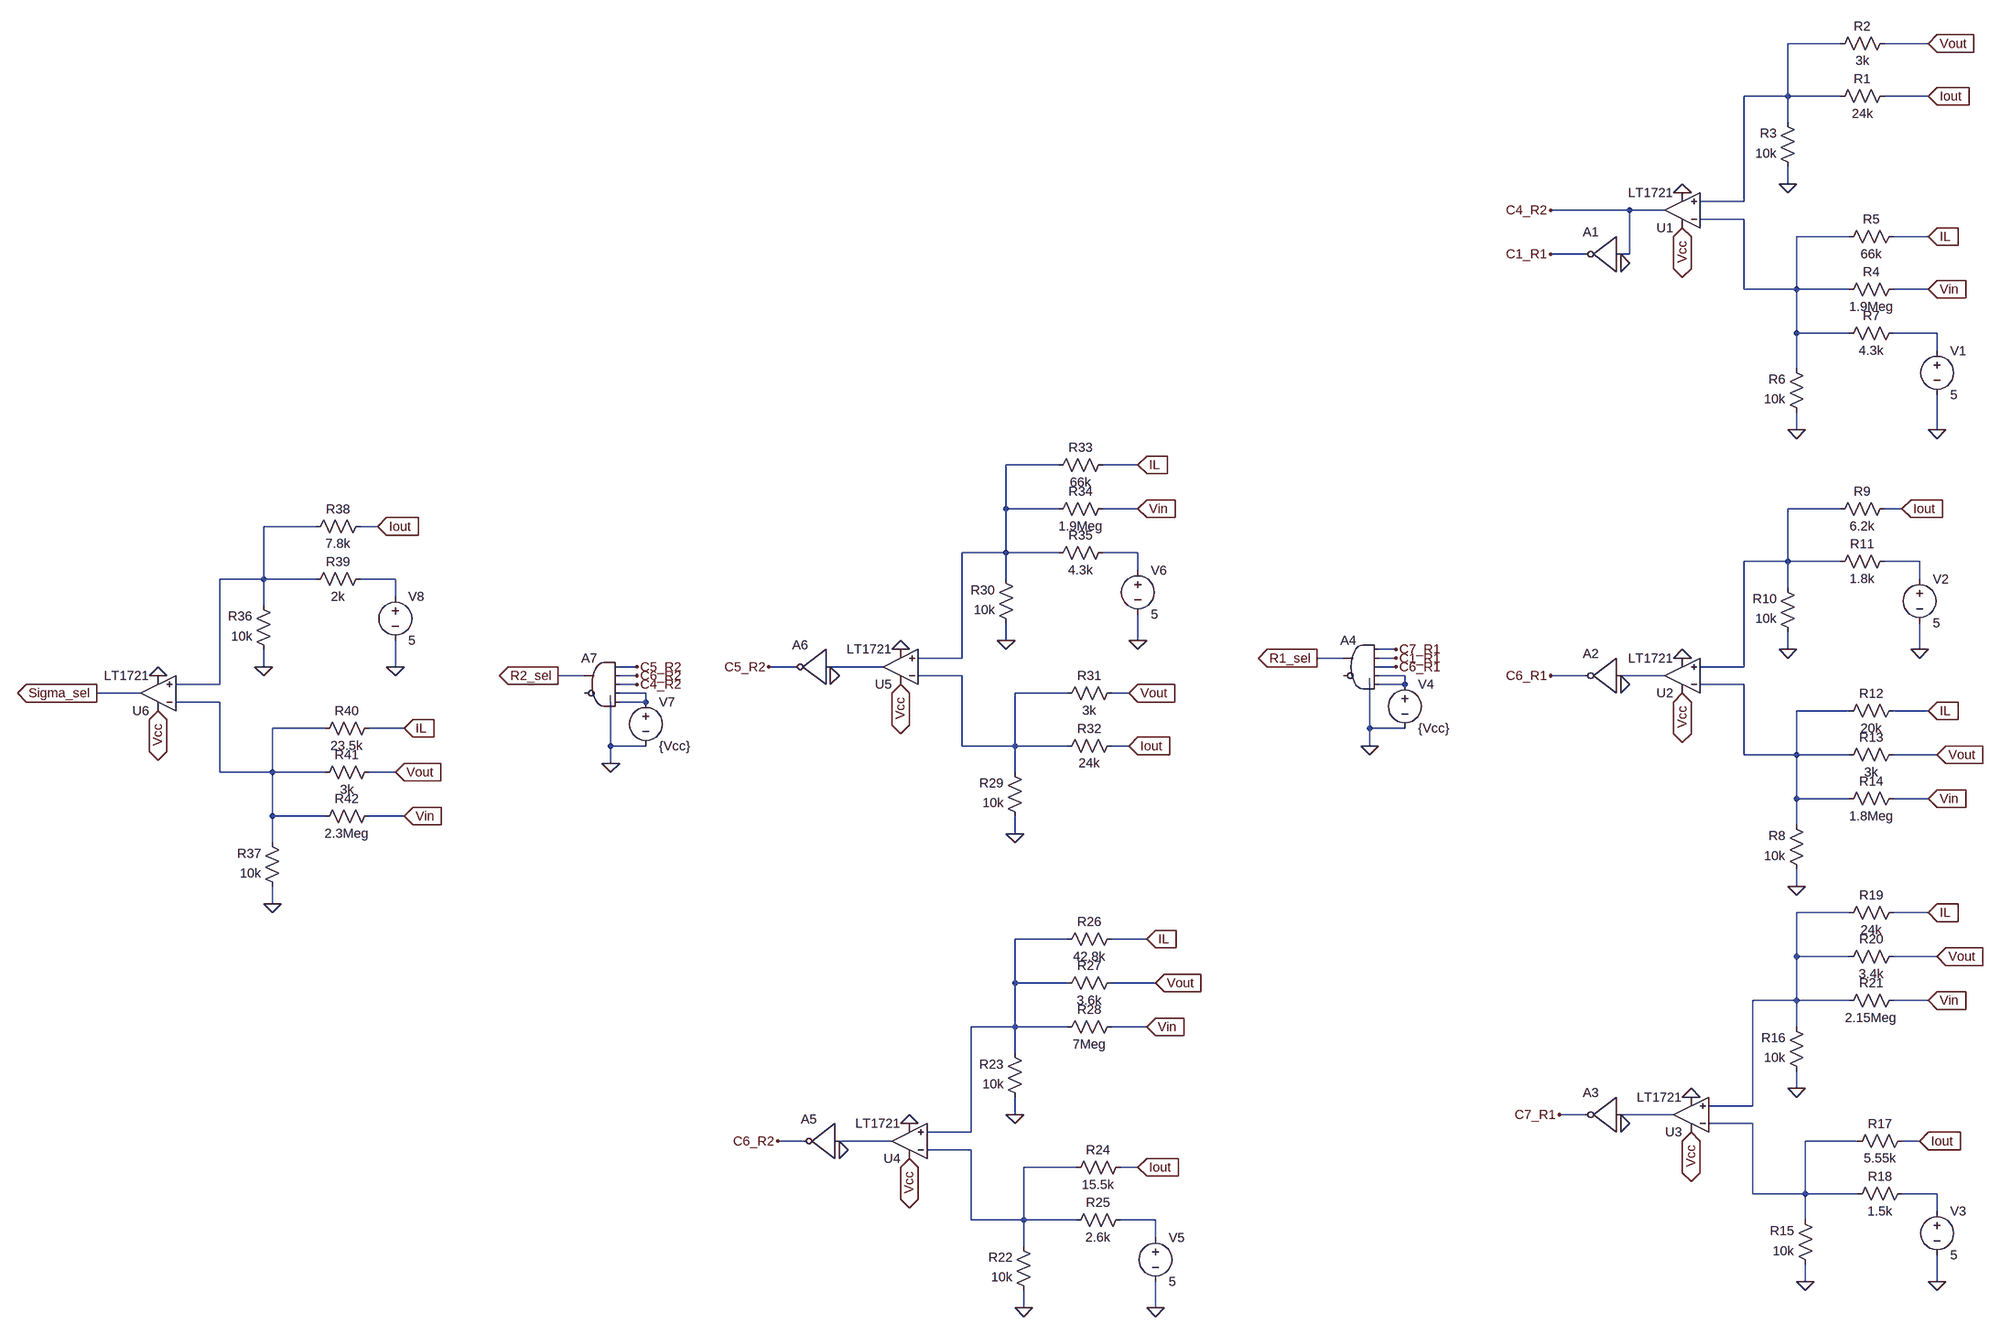
[diagram p0: schematic Region_detection.asc]
Region_detection.asc, the LTspice schematic file:
Version 4.1
SHEET 1 1664 2196
WIRE 304 -192 208 -192
WIRE 464 -192 384 -192
WIRE 208 -96 208 -192
WIRE 208 -96 128 -96
WIRE 304 -96 208 -96
WIRE 464 -96 384 -96
WIRE 208 -48 208 -96
WIRE 208 64 208 32
WIRE 128 96 128 -96
WIRE 128 96 48 96
WIRE -80 112 -224 112
WIRE -16 112 -80 112
WIRE 128 128 48 128
WIRE 320 160 224 160
WIRE 464 160 400 160
WIRE -160 192 -224 192
WIRE -80 192 -80 112
WIRE -80 192 -96 192
WIRE 128 256 128 128
WIRE 224 256 224 160
WIRE 224 256 128 256
WIRE 320 256 224 256
WIRE 464 256 400 256
WIRE 224 336 224 256
WIRE 320 336 224 336
WIRE 480 336 400 336
WIRE 480 368 480 336
WIRE 224 400 224 336
WIRE 224 512 224 480
WIRE 480 512 480 448
WIRE -1168 576 -1264 576
WIRE -1024 576 -1088 576
WIRE -1264 656 -1264 576
WIRE -1168 656 -1264 656
WIRE -1024 656 -1088 656
WIRE 304 656 208 656
WIRE 416 656 384 656
WIRE -2592 688 -2688 688
WIRE -2480 688 -2512 688
WIRE -1264 736 -1264 656
WIRE -1264 736 -1344 736
WIRE -1168 736 -1264 736
WIRE -1024 736 -1088 736
WIRE 208 752 208 656
WIRE 208 752 128 752
WIRE 304 752 208 752
WIRE 448 752 384 752
WIRE -1024 768 -1024 736
WIRE -2688 784 -2688 688
WIRE -2688 784 -2768 784
WIRE -2592 784 -2688 784
WIRE -2448 784 -2512 784
WIRE -1264 784 -1264 736
WIRE 448 784 448 752
WIRE 208 800 208 752
WIRE -2448 816 -2448 784
WIRE -2688 832 -2688 784
WIRE -1264 896 -1264 864
WIRE -1024 896 -1024 848
WIRE -512 912 -544 912
WIRE 208 912 208 880
WIRE 448 912 448 864
WIRE -1344 928 -1344 736
WIRE -1344 928 -1424 928
WIRE -608 928 -656 928
WIRE -512 928 -544 928
WIRE -2688 944 -2688 912
WIRE -2448 944 -2448 896
WIRE -1936 944 -1968 944
WIRE -1648 944 -1696 944
WIRE -1488 944 -1584 944
WIRE -512 944 -544 944
WIRE 128 944 128 752
WIRE 128 944 48 944
WIRE -2032 960 -2080 960
WIRE -1936 960 -1968 960
WIRE -1344 960 -1424 960
WIRE -496 960 -544 960
WIRE -160 960 -224 960
WIRE -16 960 -96 960
WIRE -2768 976 -2768 784
WIRE -2768 976 -2848 976
WIRE -1936 976 -1968 976
WIRE -496 976 -496 960
WIRE -496 976 -544 976
WIRE 128 976 48 976
WIRE -2912 992 -2992 992
WIRE -1920 992 -1968 992
WIRE -1152 992 -1248 992
WIRE -1040 992 -1072 992
WIRE -2768 1008 -2848 1008
WIRE -1920 1008 -1920 992
WIRE -1920 1008 -1968 1008
WIRE 320 1024 224 1024
WIRE 464 1024 400 1024
WIRE -2576 1056 -2672 1056
WIRE -2432 1056 -2496 1056
WIRE -560 1056 -560 976
WIRE -496 1056 -560 1056
WIRE -1984 1088 -1984 1008
WIRE -1920 1088 -1984 1088
WIRE -1344 1088 -1344 960
WIRE -1248 1088 -1248 992
WIRE -1248 1088 -1344 1088
WIRE -1152 1088 -1248 1088
WIRE -1040 1088 -1072 1088
WIRE -560 1088 -560 1056
WIRE 128 1104 128 976
WIRE 224 1104 224 1024
WIRE 224 1104 128 1104
WIRE 320 1104 224 1104
WIRE 480 1104 400 1104
WIRE -1984 1120 -1984 1088
WIRE -2768 1136 -2768 1008
WIRE -2672 1136 -2672 1056
WIRE -2672 1136 -2768 1136
WIRE -2576 1136 -2672 1136
WIRE -2448 1136 -2496 1136
WIRE -1248 1136 -1248 1088
WIRE 224 1184 224 1104
WIRE 320 1184 224 1184
WIRE 464 1184 400 1184
WIRE -2672 1216 -2672 1136
WIRE -2576 1216 -2672 1216
WIRE -2432 1216 -2496 1216
WIRE 224 1232 224 1184
WIRE -1248 1248 -1248 1216
WIRE -2672 1264 -2672 1216
WIRE 224 1344 224 1312
WIRE -2672 1376 -2672 1344
WIRE 320 1392 224 1392
WIRE 464 1392 400 1392
WIRE -1152 1440 -1248 1440
WIRE -1008 1440 -1072 1440
WIRE 224 1472 224 1392
WIRE 320 1472 224 1472
WIRE 480 1472 400 1472
WIRE -1248 1520 -1248 1440
WIRE -1152 1520 -1248 1520
WIRE -992 1520 -1072 1520
WIRE 224 1552 224 1472
WIRE 224 1552 144 1552
WIRE 320 1552 224 1552
WIRE 464 1552 400 1552
WIRE -1248 1600 -1248 1520
WIRE -1248 1600 -1328 1600
WIRE -1152 1600 -1248 1600
WIRE -1008 1600 -1072 1600
WIRE 224 1600 224 1552
WIRE -1248 1648 -1248 1600
WIRE 224 1712 224 1680
WIRE 144 1744 144 1552
WIRE 144 1744 64 1744
WIRE -1248 1760 -1248 1728
WIRE -160 1760 -208 1760
WIRE 0 1760 -96 1760
WIRE 144 1776 64 1776
WIRE -1328 1792 -1328 1600
WIRE -1328 1792 -1408 1792
WIRE -1632 1808 -1680 1808
WIRE -1472 1808 -1568 1808
WIRE 336 1808 240 1808
WIRE 448 1808 416 1808
WIRE -1328 1824 -1408 1824
WIRE -1136 1856 -1232 1856
WIRE -1024 1856 -1056 1856
WIRE 144 1904 144 1776
WIRE 240 1904 240 1808
WIRE 240 1904 144 1904
WIRE 336 1904 240 1904
WIRE 480 1904 416 1904
WIRE 480 1936 480 1904
WIRE -1328 1952 -1328 1824
WIRE -1232 1952 -1232 1856
WIRE -1232 1952 -1328 1952
WIRE -1136 1952 -1232 1952
WIRE -992 1952 -1056 1952
WIRE 240 1952 240 1904
WIRE -992 1984 -992 1952
WIRE -1232 2000 -1232 1952
WIRE 240 2064 240 2032
WIRE 480 2064 480 2016
WIRE -1232 2112 -1232 2080
WIRE -992 2112 -992 2064
FLAG 16 80 0
FLAG 208 64 0
FLAG 224 512 0
FLAG 464 -192 Vout
IOPIN 464 -192 In
FLAG 464 -96 Iout
IOPIN 464 -96 In
FLAG 464 160 IL
IOPIN 464 160 In
FLAG 464 256 Vin
IOPIN 464 256 In
FLAG 480 512 0
FLAG -224 192 C1_R1
FLAG 16 144 Vcc
IOPIN 16 144 BiDir
FLAG -96 208 0
FLAG -224 112 C4_R2
FLAG 16 928 0
FLAG 208 912 0
FLAG -224 960 C6_R1
FLAG 16 992 Vcc
IOPIN 16 992 BiDir
FLAG 224 1344 0
FLAG 448 912 0
FLAG 416 656 Iout
IOPIN 416 656 In
FLAG 464 1024 IL
IOPIN 464 1024 In
FLAG 480 1104 Vout
IOPIN 480 1104 In
FLAG 464 1184 Vin
IOPIN 464 1184 In
FLAG 32 1728 0
FLAG 240 2064 0
FLAG -208 1760 C7_R1
FLAG 32 1792 Vcc
IOPIN 32 1792 BiDir
FLAG 224 1712 0
FLAG 480 2064 0
FLAG 448 1808 Iout
IOPIN 448 1808 In
FLAG 464 1392 IL
IOPIN 464 1392 In
FLAG 480 1472 Vout
IOPIN 480 1472 In
FLAG 464 1552 Vin
IOPIN 464 1552 In
FLAG -96 976 0
FLAG -96 1776 0
FLAG -560 1088 0
FLAG -656 928 R1_sel
IOPIN -656 928 Out
FLAG -512 944 C6_R1
FLAG -512 928 C1_R1
FLAG -512 912 C7_R1
FLAG -1440 1776 0
FLAG -1232 2112 0
FLAG -1680 1808 C6_R2
FLAG -1440 1840 Vcc
IOPIN -1440 1840 BiDir
FLAG -1248 1760 0
FLAG -992 2112 0
FLAG -1024 1856 Iout
IOPIN -1024 1856 In
FLAG -1008 1440 IL
IOPIN -1008 1440 In
FLAG -992 1520 Vout
IOPIN -992 1520 In
FLAG -1008 1600 Vin
IOPIN -1008 1600 In
FLAG -1568 1824 0
FLAG -1456 912 0
FLAG -1248 1248 0
FLAG -1696 944 C5_R2
FLAG -1456 976 Vcc
IOPIN -1456 976 BiDir
FLAG -1264 896 0
FLAG -1024 896 0
FLAG -1040 1088 Iout
IOPIN -1040 1088 In
FLAG -1024 576 IL
IOPIN -1024 576 In
FLAG -1024 656 Vin
IOPIN -1024 656 In
FLAG -1040 992 Vout
IOPIN -1040 992 In
FLAG -1584 960 0
FLAG -1984 1120 0
FLAG -2080 960 R2_sel
IOPIN -2080 960 Out
FLAG -1936 960 C6_R2
FLAG -1936 944 C5_R2
FLAG -2880 960 0
FLAG -2688 944 0
FLAG -2880 1024 Vcc
IOPIN -2880 1024 BiDir
FLAG -2672 1376 0
FLAG -2448 944 0
FLAG -2480 688 Iout
IOPIN -2480 688 In
FLAG -2432 1056 IL
IOPIN -2432 1056 In
FLAG -2448 1136 Vout
IOPIN -2448 1136 In
FLAG -2432 1216 Vin
IOPIN -2432 1216 In
FLAG -2992 992 Sigma_sel
IOPIN -2992 992 Out
FLAG -1936 976 C4_R2
SYMBOL Comparators\\LT1721 16 176 R180
SYMATTR InstName U1
SYMBOL res 400 -112 R90
WINDOW 0 0 56 VBottom 2
WINDOW 3 32 56 VTop 2
SYMATTR InstName R1
SYMATTR Value 24k
SYMBOL res 400 -208 R90
WINDOW 0 0 56 VBottom 2
WINDOW 3 32 56 VTop 2
SYMATTR InstName R2
SYMATTR Value 3k
SYMBOL res 224 48 R180
WINDOW 0 36 76 Left 2
WINDOW 3 36 40 Left 2
SYMATTR InstName R3
SYMATTR Value 10k
SYMBOL res 416 240 R90
WINDOW 0 0 56 VBottom 2
WINDOW 3 32 56 VTop 2
SYMATTR InstName R4
SYMATTR Value 1.9Meg
SYMBOL res 416 144 R90
WINDOW 0 0 56 VBottom 2
WINDOW 3 32 56 VTop 2
SYMATTR InstName R5
SYMATTR Value 66k
SYMBOL res 240 496 R180
WINDOW 0 36 76 Left 2
WINDOW 3 36 40 Left 2
SYMATTR InstName R6
SYMATTR Value 10k
SYMBOL res 416 320 R90
WINDOW 0 0 56 VBottom 2
WINDOW 3 32 56 VTop 2
SYMATTR InstName R7
SYMATTR Value 4.3k
SYMBOL voltage 480 352 R0
WINDOW 123 0 0 Left 0
WINDOW 39 0 0 Left 0
SYMATTR InstName V1
SYMATTR Value 5
SYMBOL Digital\\inv -96 128 M0
SYMATTR InstName A1
SYMATTR SpiceLine Vhigh={Vcc_param*10} Vlow=0 Rout=10m Trise=10n Tfall=10n Ref=2.5
SYMBOL Comparators\\LT1721 16 1024 R180
SYMATTR InstName U2
SYMBOL res 224 896 R180
WINDOW 0 36 76 Left 2
WINDOW 3 36 40 Left 2
SYMATTR InstName R10
SYMATTR Value 10k
SYMBOL res 240 1328 R180
WINDOW 0 36 76 Left 2
WINDOW 3 36 40 Left 2
SYMATTR InstName R8
SYMATTR Value 10k
SYMBOL res 400 640 R90
WINDOW 0 0 56 VBottom 2
WINDOW 3 32 56 VTop 2
SYMATTR InstName R9
SYMATTR Value 6.2k
SYMBOL res 400 736 R90
WINDOW 0 0 56 VBottom 2
WINDOW 3 32 56 VTop 2
SYMATTR InstName R11
SYMATTR Value 1.8k
SYMBOL voltage 448 768 R0
WINDOW 123 0 0 Left 0
WINDOW 39 0 0 Left 0
SYMATTR InstName V2
SYMATTR Value 5
SYMBOL res 416 1008 R90
WINDOW 0 0 56 VBottom 2
WINDOW 3 32 56 VTop 2
SYMATTR InstName R12
SYMATTR Value 20k
SYMBOL res 416 1088 R90
WINDOW 0 0 56 VBottom 2
WINDOW 3 32 56 VTop 2
SYMATTR InstName R13
SYMATTR Value 3k
SYMBOL res 416 1168 R90
WINDOW 0 0 56 VBottom 2
WINDOW 3 32 56 VTop 2
SYMATTR InstName R14
SYMATTR Value 1.8Meg
SYMBOL Comparators\\LT1721 32 1824 R180
SYMATTR InstName U3
SYMBOL res 256 2048 R180
WINDOW 0 36 76 Left 2
WINDOW 3 36 40 Left 2
SYMATTR InstName R15
SYMATTR Value 10k
SYMBOL res 240 1696 R180
WINDOW 0 36 76 Left 2
WINDOW 3 36 40 Left 2
SYMATTR InstName R16
SYMATTR Value 10k
SYMBOL res 432 1792 R90
WINDOW 0 0 56 VBottom 2
WINDOW 3 32 56 VTop 2
SYMATTR InstName R17
SYMATTR Value 5.55k
SYMBOL res 432 1888 R90
WINDOW 0 0 56 VBottom 2
WINDOW 3 32 56 VTop 2
SYMATTR InstName R18
SYMATTR Value 1.5k
SYMBOL voltage 480 1920 R0
WINDOW 123 0 0 Left 0
WINDOW 39 0 0 Left 0
SYMATTR InstName V3
SYMATTR Value 5
SYMBOL res 416 1376 R90
WINDOW 0 0 56 VBottom 2
WINDOW 3 32 56 VTop 2
SYMATTR InstName R19
SYMATTR Value 24k
SYMBOL res 416 1456 R90
WINDOW 0 0 56 VBottom 2
WINDOW 3 32 56 VTop 2
SYMATTR InstName R20
SYMATTR Value 3.4k
SYMBOL res 416 1536 R90
WINDOW 0 0 56 VBottom 2
WINDOW 3 32 56 VTop 2
SYMATTR InstName R21
SYMATTR Value 2.15Meg
SYMBOL Digital\\inv -96 896 M0
SYMATTR InstName A2
SYMATTR SpiceLine Vhigh={Vcc_param*10} Vlow=0 Rout=10m Trise=10n Tfall=10n Ref=2.5
SYMBOL Digital\\inv -96 1696 M0
SYMATTR InstName A3
SYMATTR SpiceLine Vhigh={Vcc_param*10} Vlow=0 Rout=10m Trise=10n Tfall=10n Ref=2.5
SYMBOL Digital\\and -576 880 M0
SYMATTR InstName A4
SYMATTR SpiceLine Vhigh={Vcc_param*10} Vlow=0 Rout=10m Trise=10n Tfall=10n Ref=2.5
SYMBOL voltage -496 960 R0
WINDOW 123 0 0 Left 0
WINDOW 39 0 0 Left 0
SYMATTR InstName V4
SYMATTR Value {Vcc}
SYMBOL Comparators\\LT1721 -1440 1872 R180
SYMATTR InstName U4
SYMBOL res -1216 2096 R180
WINDOW 0 36 76 Left 2
WINDOW 3 36 40 Left 2
SYMATTR InstName R22
SYMATTR Value 10k
SYMBOL res -1232 1744 R180
WINDOW 0 36 76 Left 2
WINDOW 3 36 40 Left 2
SYMATTR InstName R23
SYMATTR Value 10k
SYMBOL res -1040 1840 R90
WINDOW 0 0 56 VBottom 2
WINDOW 3 32 56 VTop 2
SYMATTR InstName R24
SYMATTR Value 15.5k
SYMBOL res -1040 1936 R90
WINDOW 0 0 56 VBottom 2
WINDOW 3 32 56 VTop 2
SYMATTR InstName R25
SYMATTR Value 2.6k
SYMBOL voltage -992 1968 R0
WINDOW 123 0 0 Left 0
WINDOW 39 0 0 Left 0
SYMATTR InstName V5
SYMATTR Value 5
SYMBOL res -1056 1424 R90
WINDOW 0 0 56 VBottom 2
WINDOW 3 32 56 VTop 2
SYMATTR InstName R26
SYMATTR Value 42.8k
SYMBOL res -1056 1504 R90
WINDOW 0 0 56 VBottom 2
WINDOW 3 32 56 VTop 2
SYMATTR InstName R27
SYMATTR Value 3.6k
SYMBOL res -1056 1584 R90
WINDOW 0 0 56 VBottom 2
WINDOW 3 32 56 VTop 2
SYMATTR InstName R28
SYMATTR Value 7Meg
SYMBOL Digital\\inv -1568 1744 M0
SYMATTR InstName A5
SYMATTR SpiceLine Vhigh={Vcc_param*10} Vlow=0 Rout=10m Trise=10n Tfall=10n Ref=2.5
SYMBOL Comparators\\LT1721 -1456 1008 R180
SYMATTR InstName U5
SYMBOL res -1232 1232 R180
WINDOW 0 36 76 Left 2
WINDOW 3 36 40 Left 2
SYMATTR InstName R29
SYMATTR Value 10k
SYMBOL res -1248 880 R180
WINDOW 0 36 76 Left 2
WINDOW 3 36 40 Left 2
SYMATTR InstName R30
SYMATTR Value 10k
SYMBOL res -1056 976 R90
WINDOW 0 0 56 VBottom 2
WINDOW 3 32 56 VTop 2
SYMATTR InstName R31
SYMATTR Value 3k
SYMBOL res -1056 1072 R90
WINDOW 0 0 56 VBottom 2
WINDOW 3 32 56 VTop 2
SYMATTR InstName R32
SYMATTR Value 24k
SYMBOL voltage -1024 752 R0
WINDOW 123 0 0 Left 0
WINDOW 39 0 0 Left 0
SYMATTR InstName V6
SYMATTR Value 5
SYMBOL res -1072 560 R90
WINDOW 0 0 56 VBottom 2
WINDOW 3 32 56 VTop 2
SYMATTR InstName R33
SYMATTR Value 66k
SYMBOL res -1072 640 R90
WINDOW 0 0 56 VBottom 2
WINDOW 3 32 56 VTop 2
SYMATTR InstName R34
SYMATTR Value 1.9Meg
SYMBOL res -1072 720 R90
WINDOW 0 0 56 VBottom 2
WINDOW 3 32 56 VTop 2
SYMATTR InstName R35
SYMATTR Value 4.3k
SYMBOL Digital\\inv -1584 880 M0
SYMATTR InstName A6
SYMATTR SpiceLine Vhigh={Vcc_param*10} Vlow=0 Rout=10m Trise=10n Tfall=10n Ref=2.5
SYMBOL Digital\\and -2000 912 M0
SYMATTR InstName A7
SYMATTR SpiceLine Vhigh={Vcc_param*10} Vlow=0 Rout=10m Trise=10n Tfall=10n Ref=2.5
SYMBOL voltage -1920 992 R0
WINDOW 123 0 0 Left 0
WINDOW 39 0 0 Left 0
SYMATTR InstName V7
SYMATTR Value {Vcc}
SYMBOL Comparators\\LT1721 -2880 1056 R180
SYMATTR InstName U6
SYMBOL res -2672 928 R180
WINDOW 0 36 76 Left 2
WINDOW 3 36 40 Left 2
SYMATTR InstName R36
SYMATTR Value 10k
SYMBOL res -2656 1360 R180
WINDOW 0 36 76 Left 2
WINDOW 3 36 40 Left 2
SYMATTR InstName R37
SYMATTR Value 10k
SYMBOL res -2496 672 R90
WINDOW 0 0 56 VBottom 2
WINDOW 3 32 56 VTop 2
SYMATTR InstName R38
SYMATTR Value 7.8k
SYMBOL res -2496 768 R90
WINDOW 0 0 56 VBottom 2
WINDOW 3 32 56 VTop 2
SYMATTR InstName R39
SYMATTR Value 2k
SYMBOL voltage -2448 800 R0
WINDOW 123 0 0 Left 0
WINDOW 39 0 0 Left 0
SYMATTR InstName V8
SYMATTR Value 5
SYMBOL res -2480 1040 R90
WINDOW 0 0 56 VBottom 2
WINDOW 3 32 56 VTop 2
SYMATTR InstName R40
SYMATTR Value 23.5k
SYMBOL res -2480 1120 R90
WINDOW 0 0 56 VBottom 2
WINDOW 3 32 56 VTop 2
SYMATTR InstName R41
SYMATTR Value 3k
SYMBOL res -2480 1200 R90
WINDOW 0 0 56 VBottom 2
WINDOW 3 32 56 VTop 2
SYMATTR InstName R42
SYMATTR Value 2.3Meg

The netlist it stands for:
* Region_detection.asc
X§U1 N001 N002 Vcc 0 C4_R2 LT1720  ; LT1721, pins In+ In- V+ V- OUT
R1 Iout N001 24k
R2 Vout N001 3k
R3 0 N001 10k
R4 Vin N002 1.9Meg
R5 IL N002 66k
R6 0 N002 10k
R7 N003 N002 4.3k
V1 N003 0 5
A1 C4_R2 0 0 0 0 C1_R1 0 0 BUF Vhigh={Vcc_param*10} Vlow=0 Rout=10m Trise=10n Tfall=10n Ref=2.5
X§U2 N005 N014 Vcc 0 N013 LT1720  ; LT1721, pins In+ In- V+ V- OUT
R10 0 N005 10k
R8 0 N014 10k
R9 Iout N005 6.2k
R11 N008 N005 1.8k
V2 N008 0 5
R12 IL N014 20k
R13 Vout N014 3k
R14 Vin N014 1.8Meg
X§U3 N017 N020 Vcc 0 N019 LT1720  ; LT1721, pins In+ In- V+ V- OUT
R15 0 N020 10k
R16 0 N017 10k
R17 Iout N020 5.55k
R18 N023 N020 1.5k
V3 N023 0 5
R19 IL N017 24k
R20 Vout N017 3.4k
R21 Vin N017 2.15Meg
A2 N013 0 0 0 0 C6_R1 0 0 BUF Vhigh={Vcc_param*10} Vlow=0 Rout=10m Trise=10n Tfall=10n Ref=2.5
A3 N019 0 0 0 0 C7_R1 0 0 BUF Vhigh={Vcc_param*10} Vlow=0 Rout=10m Trise=10n Tfall=10n Ref=2.5
A4 C7_R1 C1_R1 C6_R1 N012 N012 0 R1_sel 0 AND Vhigh={Vcc_param*10} Vlow=0 Rout=10m Trise=10n Tfall=10n Ref=2.5
V4 N012 0 {Vcc}
X§U4 N018 N022 Vcc 0 N021 LT1720  ; LT1721, pins In+ In- V+ V- OUT
R22 0 N022 10k
R23 0 N018 10k
R24 Iout N022 15.5k
R25 N024 N022 2.6k
V5 N024 0 5
R26 IL N018 42.8k
R27 Vout N018 3.6k
R28 Vin N018 7Meg
A5 N021 0 0 0 0 C6_R2 0 0 BUF Vhigh={Vcc_param*10} Vlow=0 Rout=10m Trise=10n Tfall=10n Ref=2.5
X§U5 N004 N011 Vcc 0 N010 LT1720  ; LT1721, pins In+ In- V+ V- OUT
R29 0 N011 10k
R30 0 N004 10k
R31 Vout N011 3k
R32 Iout N011 24k
V6 N007 0 5
R33 IL N004 66k
R34 Vin N004 1.9Meg
R35 N007 N004 4.3k
A6 N010 0 0 0 0 C5_R2 0 0 BUF Vhigh={Vcc_param*10} Vlow=0 Rout=10m Trise=10n Tfall=10n Ref=2.5
A7 C5_R2 C6_R2 C4_R2 N015 N015 0 R2_sel 0 AND Vhigh={Vcc_param*10} Vlow=0 Rout=10m Trise=10n Tfall=10n Ref=2.5
V7 N015 0 {Vcc}
X§U6 N006 N016 Vcc 0 Sigma_sel LT1720  ; LT1721, pins In+ In- V+ V- OUT
R36 0 N006 10k
R37 0 N016 10k
R38 Iout N006 7.8k
R39 N009 N006 2k
V8 N009 0 5
R40 IL N016 23.5k
R41 Vout N016 3k
R42 Vin N016 2.3Meg
.lib LTC.lib
.backanno
.end